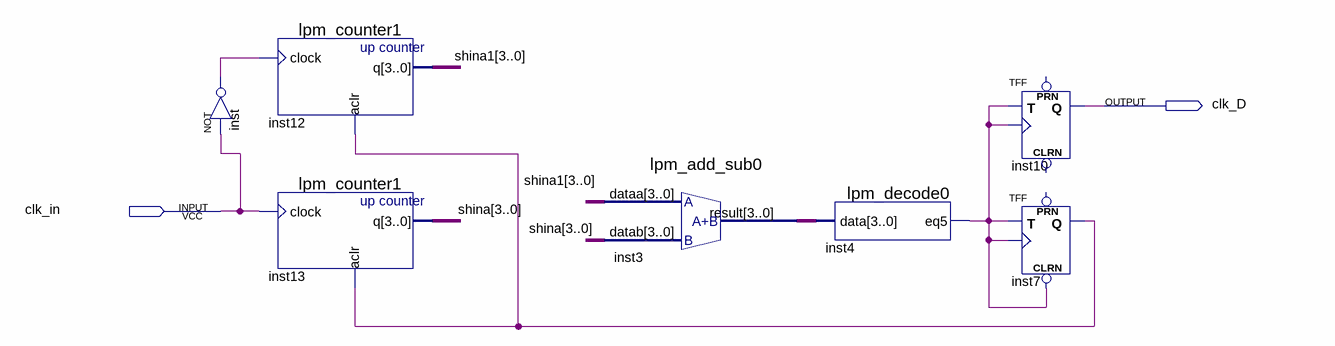
[diagram p0: schematic sheet]
// Quartus schematic Block2.bdf as structural Verilog: 7 symbols, 2 pins
module Block2 (
  input  clk_in,
  output clk_D
);

  wire inst4_eq5, inst7_q, inst_out;
  wire [3:0] inst3_result, shina, shina1;

  not inst (inst_out, clk_in);
  lpm_counter1 inst12 (.clock(inst_out), .aclr(inst7_q), .q(shina1));
  lpm_counter1 inst13 (.clock(clk_in), .aclr(inst7_q), .q(shina));
  lpm_add_sub0 inst3 (.dataa(shina1), .datab(shina), .result(inst3_result));
  lpm_decode0 inst4 (.data(inst3_result), .eq5(inst4_eq5));
  TFF inst10 (.T(inst4_eq5), .CLK(inst4_eq5), .Q(clk_D));  // open: PRN, CLRN
  TFF inst7 (.CLRN(inst4_eq5), .T(inst4_eq5), .CLK(inst4_eq5), .Q(inst7_q));  // open: PRN
endmodule
